# Altium schematic sheet OveralSchematic.SchDoc
size A4; SheetNumber: 5; SheetTotal: 8
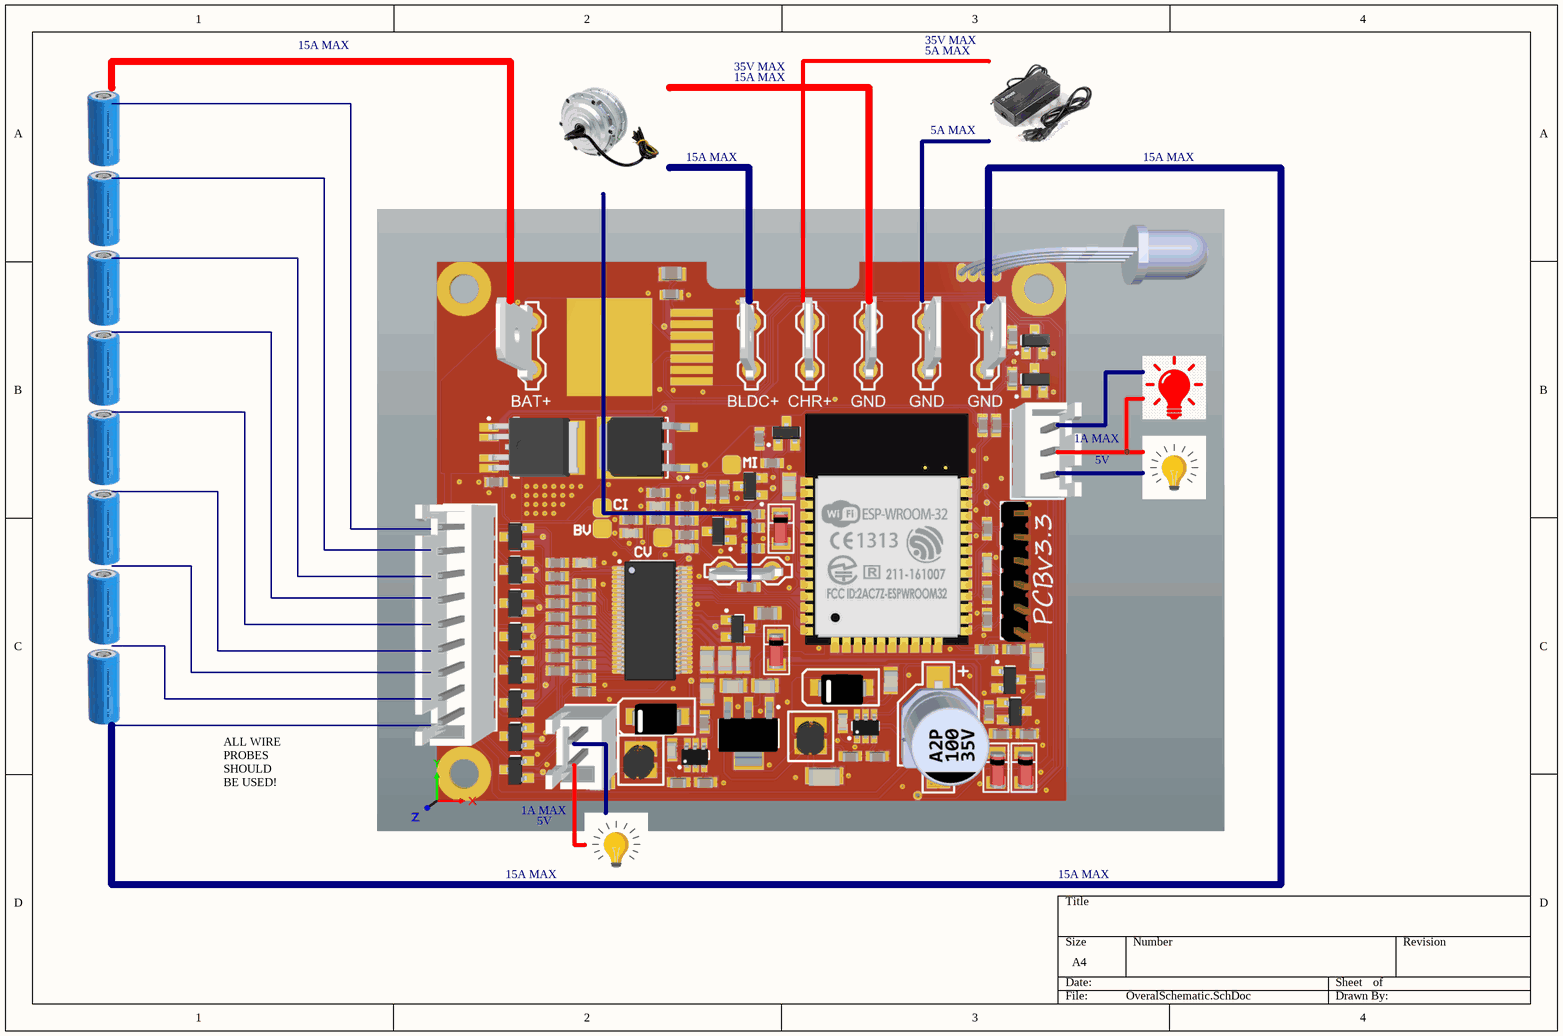
[diagram p0: OveralSchematic.SchDoc]

## Notes on the sheet
- 35V MAX
- 15A MAX
- 5A MAX
- 1A MAX
- 5V
- ALL WIRE PROBES SHOULD BE USED!